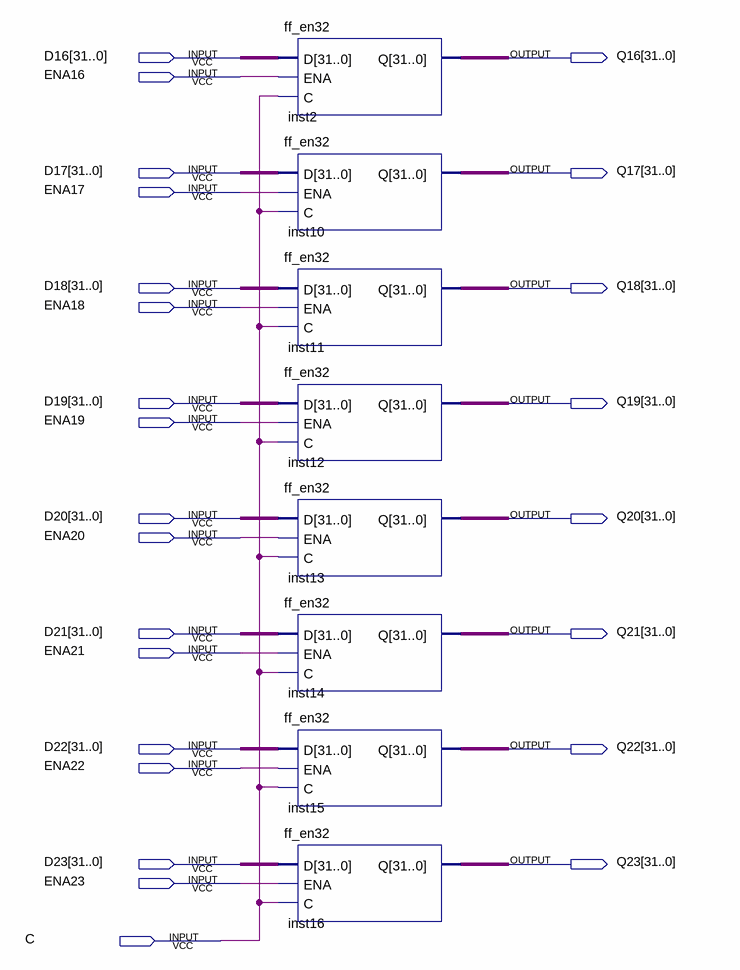
[diagram p0: schematic sheet]
// Quartus schematic ff8_en32_2.bdf as structural Verilog: 8 symbols, 25 pins
module ff8_en32_2 (
  input  [31:0] D16,
  input  ENA16,
  input  [31:0] D17,
  input  ENA17,
  input  [31:0] D18,
  input  ENA18,
  input  [31:0] D19,
  input  ENA19,
  input  [31:0] D20,
  input  ENA20,
  input  [31:0] D21,
  input  ENA21,
  input  [31:0] D22,
  input  ENA22,
  input  [31:0] D23,
  input  ENA23,
  input  C,
  output [31:0] Q16,
  output [31:0] Q17,
  output [31:0] Q18,
  output [31:0] Q19,
  output [31:0] Q20,
  output [31:0] Q21,
  output [31:0] Q22,
  output [31:0] Q23
);

  ff_en32 inst2 (.D(D16), .ENA(ENA16), .C(C), .Q(Q16));
  ff_en32 inst10 (.D(D17), .ENA(ENA17), .C(C), .Q(Q17));
  ff_en32 inst11 (.D(D18), .ENA(ENA18), .C(C), .Q(Q18));
  ff_en32 inst12 (.D(D19), .ENA(ENA19), .C(C), .Q(Q19));
  ff_en32 inst13 (.D(D20), .ENA(ENA20), .C(C), .Q(Q20));
  ff_en32 inst14 (.D(D21), .ENA(ENA21), .C(C), .Q(Q21));
  ff_en32 inst15 (.D(D22), .ENA(ENA22), .C(C), .Q(Q22));
  ff_en32 inst16 (.D(D23), .ENA(ENA23), .C(C), .Q(Q23));
endmodule
